# EAGLE schematic SyncScan Standalone MK3 SMD (EAGLE 6.2)
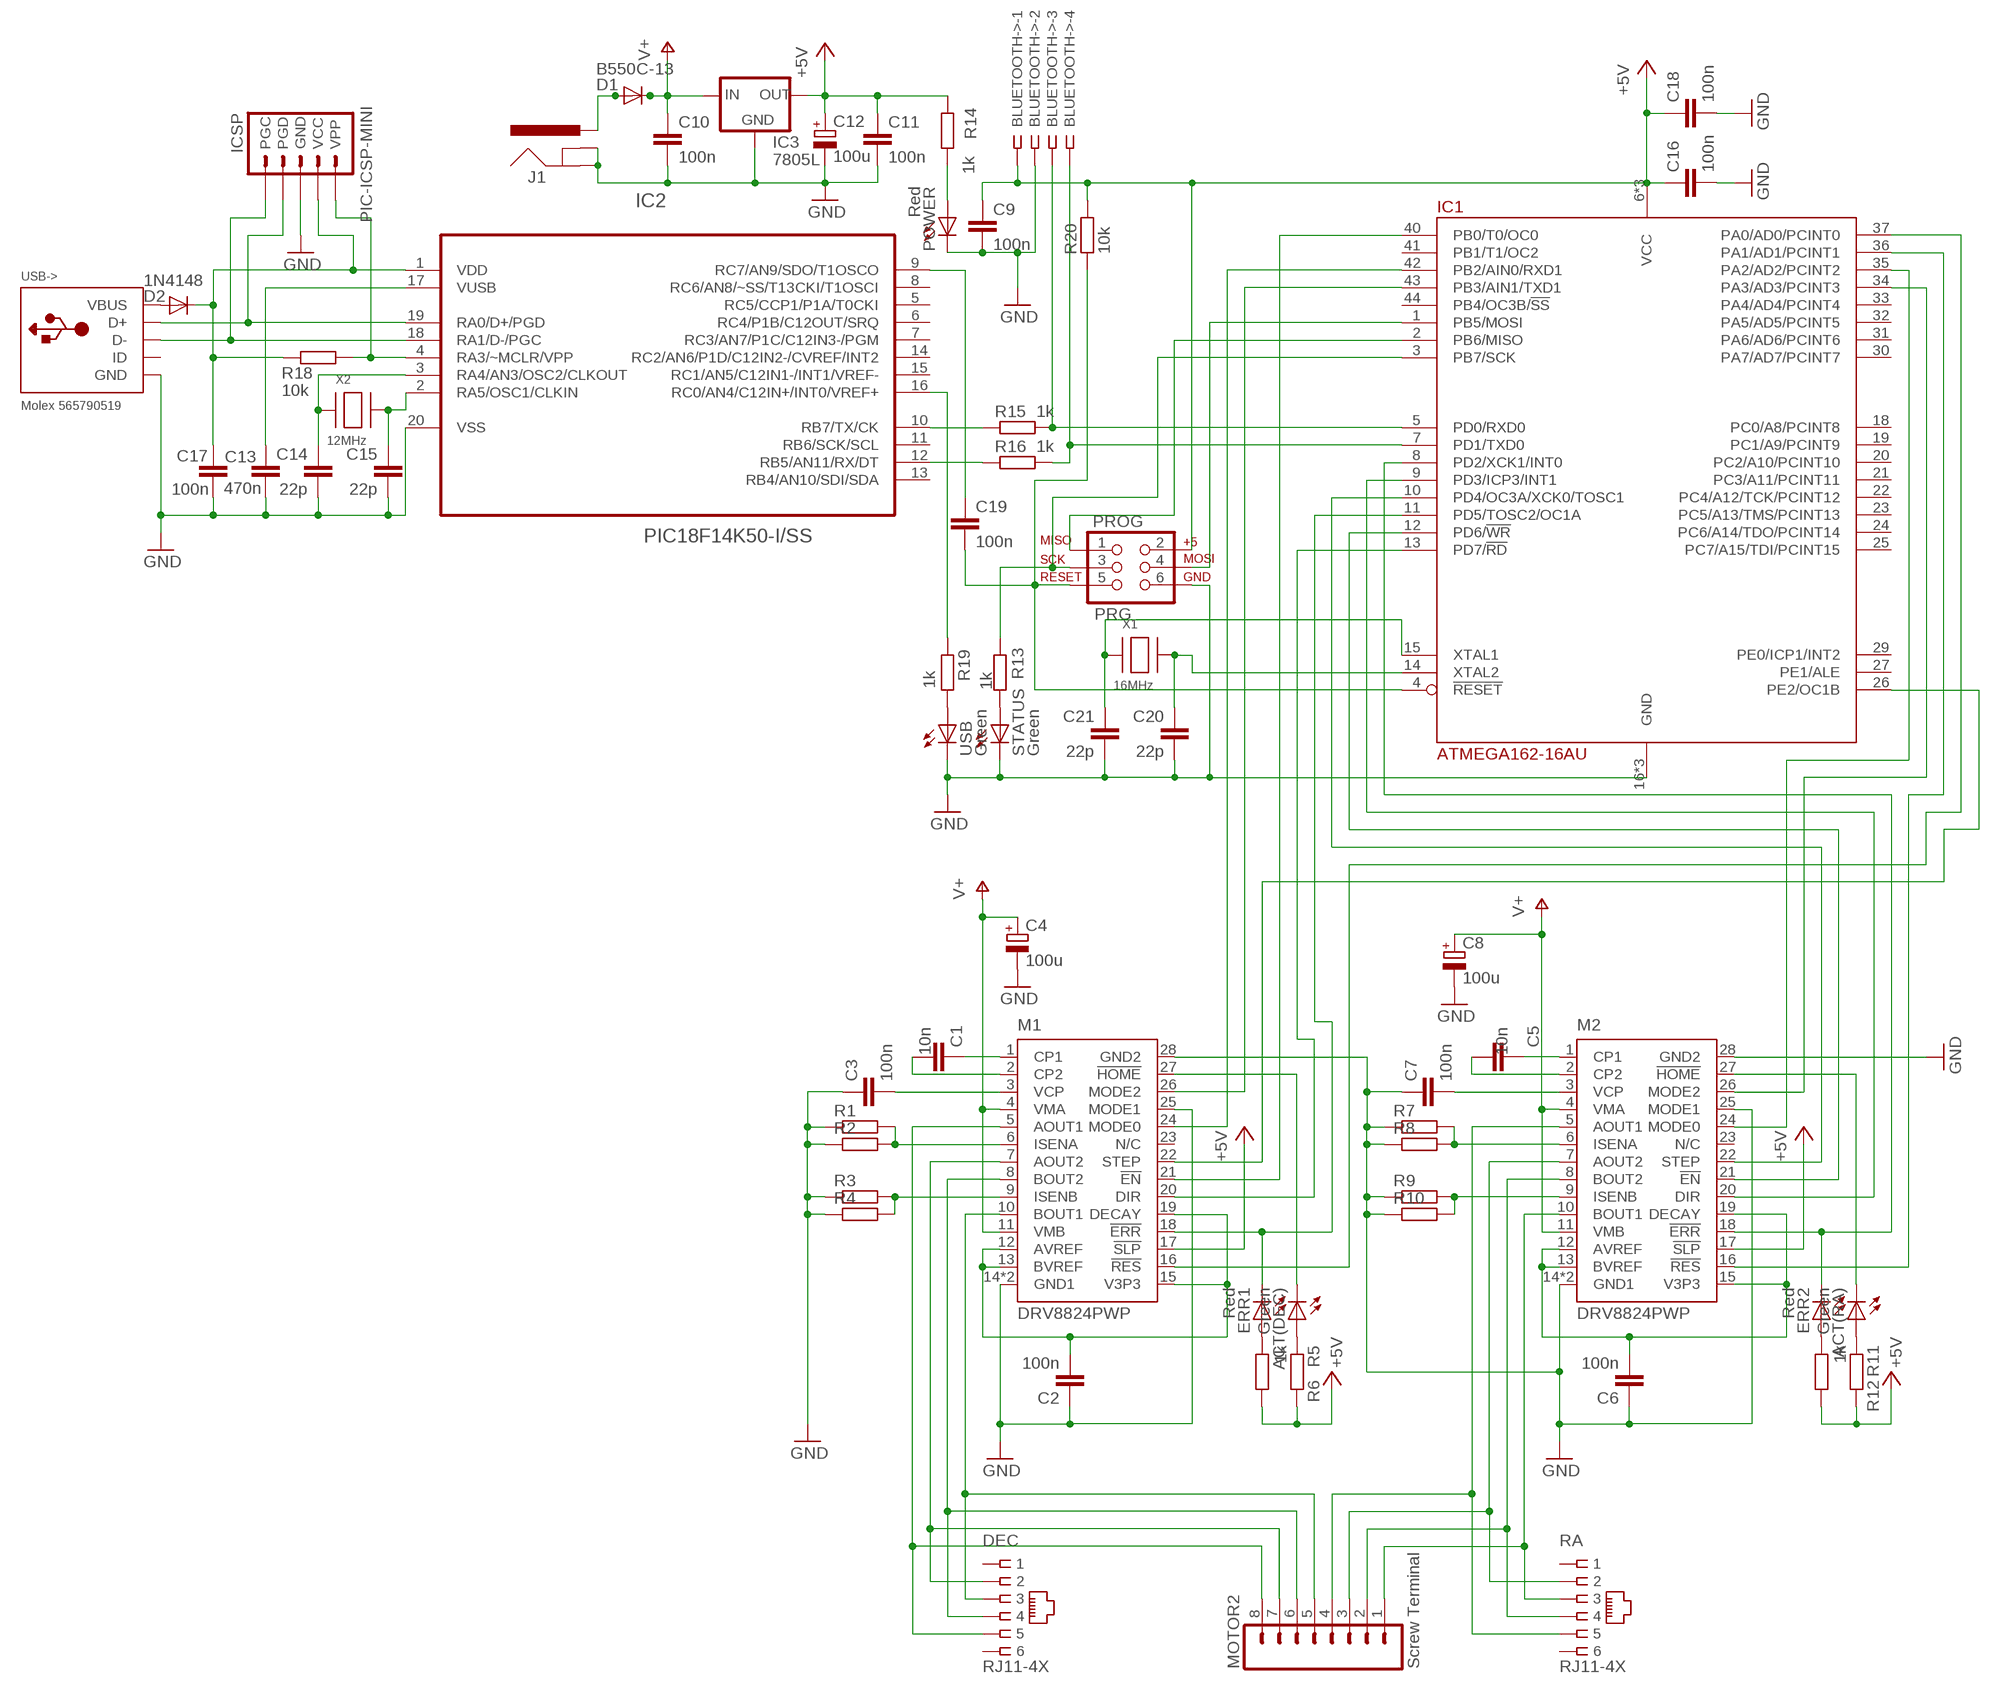
[diagram p0: schematic, sheet 1]

## Parts
ACT(DEC)  Green  LEDSMT1206  [1206]
ACT(RA)  Green  LEDSMT1206  [1206]
BLUETOOTH->  http://www.ebay.co.uk/itm/250991624201  SSW-104-02-S-S-RA  [SSW-104-02-S-S-RA]
C1  10n  C-EUC0603K  [C0603K]
C2  100n  C-EUC0603K  [C0603K]
C3  100n  C-EUC0603K  [C0603K]
C4  100u  CPOL-EUE2.5-6  [E2,5-6]
C5  10n  C-EUC0603K  [C0603K]
C6  100n  C-EUC0603K  [C0603K]
C7  100n  C-EUC0603K  [C0603K]
C8  100u  CPOL-EUE2.5-6  [E2,5-6]
C9  100n  C-EUC0603K  [C0603K]
C10  100n  C-EUC0603K  [C0603K]
C11  100n  C-EUC0603K  [C0603K]
C12  100u  CPOL-EUE2.5-6  [E2,5-6]
C13  470n  C-EUC0603K  [C0603K]
C14  22p  C-EUC0603K  [C0603K]
C15  22p  C-EUC0603K  [C0603K]
C16  100n  C-EUC0603K  [C0603K]
C17  100n  C-EUC0603K  [C0603K]
C18  100n  C-EUC0603K  [C0603K]
C19  100n  C-EUC0603K  [C0603K]
C20  22p  C-EUC0603K  [C0603K]
C21  22p  C-EUC0603K  [C0603K]
D1  B550C-13  DIODE-SMC  [SMC]
D2  1N4148  DIODESOD  [SOD-323]
DEC  RJ11-4X  [RJ11-NO_SHIELD]
ERR1  Red  LEDSMT1206  [1206]
ERR2  Red  LEDSMT1206  [1206]
IC1  ATMEGA162-16AU  [TQFP44]
IC2  PIC18F14K50-I/SS  [SSOP20]
IC3  7805L  78LXXSOT-23  [SOT23]
ICSP  PIC-ICSP-MINI  [PIC-ICSP-MINI]
J1  POWER_JACKSMD  [POWER_JACK_SMD]
M1  DRV8824PWP  [HTSSOP28PWP]
M2  DRV8824PWP  [HTSSOP28PWP]
MOTOR2  Screw Terminal  M083.5MM-8  [SCREWTERMINAL-3.5MM-8]
POWER  Red  LEDSMT1206  [1206]
PROG  PRG  AVR_SPI_PRG_6PTH  [2X3]
R1  1.5R  R-EU_R2512  [R2512]
R2  1.5R  R-EU_R2512  [R2512]
R3  1.5R  R-EU_R2512  [R2512]
R4  1.5R  R-EU_R2512  [R2512]
R5  1k  R-EU_R0603  [R0603]
R6  1k  R-EU_R0603  [R0603]
R7  1.5R  R-EU_R2512  [R2512]
R8  1.5R  R-EU_R2512  [R2512]
R9  1.5R  R-EU_R2512  [R2512]
R10  1.5R  R-EU_R2512  [R2512]
R11  1k  R-EU_R0603  [R0603]
R12  1k  R-EU_R0603  [R0603]
R13  1k  R-EU_R0603  [R0603]
R14  1k  R-EU_R0603  [R0603]
R15  1k  R-EU_R0603  [R0603]
R16  1k  R-EU_R0603  [R0603]
R18  10k  R-EU_R0603  [R0603]
R19  1k  R-EU_R0603  [R0603]
R20  10k  R-EU_R0603  [R0603]
RA  RJ11-4X  [RJ11-NO_SHIELD]
STATUS  Green  LEDSMT1206  [1206]
USB  Green  LEDSMT1206  [1206]
USB->  Molex 565790519  USBMOLEX  [USB-MINIB-THM-MOLEX]
X1  16MHz  XTALNX5032  [NX5032]
X2  12MHz  XTALNX5032  [NX5032]

## Nets
3.3V-1: C2.2 M1.12(AVREF) M1.13(BVREF) M1.15(V3P3) M1.19(DECAY)
3.3V-2: C6.2 M2.12(AVREF) M2.13(BVREF) M2.15(V3P3) M2.19(DECAY)
!EN-1: IC1.40(PB0/T0/OC0) M1.21(!EN)
!EN-2: IC1.12(PD6/!WR) M2.21(!EN)
!ERR-1: ERR1.C IC1.11(PD5/TOSC2/OC1A) M1.18(!ERR)
!ERR-2: ERR2.C IC1.8(PD2/XCK1/INT0) M2.18(!ERR)
!HOME-1: ACT(DEC).C M1.27(!HOME)
!HOME-2: ACT(RA).C M2.27(!HOME)
!RST-1: IC1.37(PA0/AD0/PCINT0) M1.16(!RES)
!RST-2: IC1.36(PA1/AD1/PCINT1) M2.16(!RES)
+5V: BLUETOOTH->.1 C9.1 C11.1 C12.+ C16.1 C18.1 IC1.6(VCC) IC1.17(VCC) IC1.38(VCC) IC3.1(OUT) M1.17(!SLP) M2.17(!SLP) PROG.2 R5.2 R6.2 R11.2 R12.2 R14.1 R20.2
A1-1: DEC.5 M1.5(AOUT1) MOTOR2.8
A1-2: M2.5(AOUT1) MOTOR2.4 RA.5
A2-1: DEC.2 M1.7(AOUT2) MOTOR2.7
A2-2: M2.7(AOUT2) MOTOR2.3 RA.2
AVROSC1: C21.1 IC1.15(XTAL1) X1.P$1
AVROSC2: C20.1 IC1.14(XTAL2) X1.P$2
B1-1: DEC.3 M1.10(BOUT1) MOTOR2.5
B1-2: M2.10(BOUT1) MOTOR2.1 RA.3
B2-1: DEC.4 M1.8(BOUT2) MOTOR2.6
B2-2: M2.8(BOUT2) MOTOR2.2 RA.4
CP1-1: C1.1 M1.1(CP1)
CP1-2: C5.1 M2.1(CP1)
CP2-1: C1.2 M1.2(CP2)
CP2-2: C5.2 M2.2(CP2)
D+: IC2.19(RA0/D+/PGD) ICSP.4(PGD) USB->.D+
D-: IC2.18(RA1/D-/PGC) ICSP.5(PGC) USB->.D-
DIR-1: IC1.13(PD7/!RD) M1.20(DIR)
DIR-2: IC1.9(PD3/ICP3/INT1) M2.20(DIR)
GND: BLUETOOTH->.2 C2.1 C3.1 C4.- C6.1 C7.1 C8.- C9.2 C10.2 C11.2 C12.- C13.1 C14.2 C15.2 C16.2 C17.2 C18.2 C20.2 C21.2 IC1.16(GND) IC1.28(GND) IC1.39(GND) IC2.20(VSS) IC3.3(GND) ICSP.3(GND) J1.GND(GNDBREAK) J1.P$4(GND) M1.14(GND1) M1.25(MODE1) M1.28(GND2) M1.EXP(GND1) M2.14(GND1) M2.25(MODE1) M2.28(GND2) M2.EXP(GND1) POWER.C PROG.6 R1.1 R2.1 R3.1 R4.1 R7.1 R8.1 R9.1 R10.1 STATUS.C USB->.GND USB.C
ISENA-1: M1.6(ISENA) R1.2 R2.2
ISENA-2: M2.6(ISENA) R7.2 R8.2
ISENB-1: M1.9(ISENB) R3.2 R4.2
ISENB-2: M2.9(ISENB) R9.2 R10.2
LED1: ERR1.A R6.1
LED2: ACT(DEC).A R5.1
LED3: ERR2.A R12.1
LED4: ACT(RA).A R11.1
M0-1: IC1.42(PB2/AIN0/RXD1) M1.24(MODE0)
M0-2: IC1.35(PA2/AD2/PCINT2) M2.24(MODE0)
M2-1: IC1.43(PB3/AIN1/TXD1) M1.26(MODE2)
M2-2: IC1.34(PA3/AD3/PCINT3) M2.26(MODE2)
MCLR: IC2.4(RA3/~MCLR/VPP) ICSP.1(VPP) R18.1
MISO: IC1.2(PB6/MISO) PROG.1
MOSI: IC1.1(PB5/MOSI) PROG.4
N$1: C3.2 M1.3(VCP)
N$2: C19.1 IC2.9(RC7/AN9/SDO/T1OSCO)
PWRLED: POWER.A R14.2
RESET: C19.2 IC1.4(!RESET) PROG.5 R20.1
RX(BTH): BLUETOOTH->.4 IC1.7(PD1/TXD0) R16.1
RX(USB): IC2.12(RB5/AN11/RX/DT) R16.2
SCLK: IC1.3(PB7/SCK) PROG.3 R13.1
STATLED: R13.2 STATUS.A
STEP-1: IC1.26(PE2/OC1B) M1.22(STEP)
STEP-2: IC1.10(PD4/OC3A/XCK0/TOSC1) M2.22(STEP)
TX(BTH): BLUETOOTH->.3 IC1.5(PD0/RXD0) R15.1
TX(USB): IC2.10(RB7/TX/CK) R15.2
USBLED: R19.1 USB.A
USBOSC1: C15.1 IC2.2(RA5/OSC1/CLKIN) X2.P$2
USBOSC2: C14.1 IC2.3(RA4/AN3/OSC2/CLKOUT) X2.P$1
USBSTAT: IC2.16(RC0/AN4/C12IN+/INT0/VREF+) R19.2
V+: C4.+ C8.+ C10.1 D1.C IC3.2(IN) M1.4(VMA) M1.11(VMB) M2.4(VMA) M2.11(VMB)
VBUS: D2.2(A) USB->.VBUS
VCP-2: C7.2 M2.3(VCP)
VIN: D1.A J1.VIN0(PWR) J1.VIN1(PWR)
VPIC: C17.1 D2.1(C) IC2.1(VDD) ICSP.2(VCC) R18.2
VUSB: C13.2 IC2.17(VUSB)
Unconnected: DEC.1 DEC.6 IC1.18(PC0/A8/PCINT8) IC1.19(PC1/A9/PCINT9) IC1.20(PC2/A10/PCINT10) IC1.21(PC3/A11/PCINT11) IC1.22(PC4/A12/TCK/PCINT12) IC1.23(PC5/A13/TMS/PCINT13) IC1.24(PC6/A14/TDO/PCINT14) IC1.25(PC7/A15/TDI/PCINT15) IC1.27(PE1/ALE) IC1.29(PE0/ICP1/INT2) IC1.30(PA7/AD7/PCINT7) IC1.31(PA6/AD6/PCINT6) IC1.32(PA5/AD5/PCINT5) IC1.33(PA4/AD4/PCINT4) IC1.41(PB1/T1/OC2) IC1.44(PB4/OC3B/!SS) IC2.5(RC5/CCP1/P1A/T0CKI) IC2.6(RC4/P1B/C12OUT/SRQ) IC2.7(RC3/AN7/P1C/C12IN3-/PGM) IC2.8(RC6/AN8/~SS/T13CKI/T1OSCI) IC2.11(RB6/SCK/SCL) IC2.13(RB4/AN10/SDI/SDA) IC2.14(RC2/AN6/P1D/C12IN2-/CVREF/INT2) IC2.15(RC1/AN5/C12IN1-/INT1/VREF-) M1.23(N/C) M2.23(N/C) RA.1 RA.6 USB->.ID

## Library data of the parts
ACT(DEC) ACT(RA) STATUS USB = led:LED: LED OSRAM: - CHIPLED LG R971, LG N971, LY N971, LG Q971, LY Q971, LO R971, LY R971 LH N974, LH R974 LS Q976, LO Q976, LY Q976 LO Q996 - Hyper CHIPLED LW Q18S LB Q993, LB Q99A, LB R99A - SideLED LS A670, LO A670, LY A670, LG A670, LP A670 LB A673, LV A673, LT A673, LW A673 LH A674 LY A675 LS A676, LA A676, LO A676, LY A676, LW A676 LS A679, LY A679, LG A679 - Hyper Micro SIDELED® LS Y876, LA Y876, LO Y876, LY Y876 LT Y87S - SmartLED LW L88C, LW L88S LB L89C, LB L89S, LG L890 LS L89K, LO L89K, LY L89K LS L896, LA L896, LO L896, LY L896 - TOPLED LS T670, LO T670, LY T670, LG T670, LP T670 LSG T670, LSP T670, LSY T670, LOP T670, LYG T670 LG T671, LOG T671, LSG T671 LB T673, LV T673, LT T673, LW T673 LH T674 LS T676, LA T676, LO T676, LY T676, LB T676, LH T676, LSB T676, LW T676 LB T67C, LV T67C, LT T67C, LS T67K, LO T67K, LY T67K, LW E67C LS E67B, LA E67B, LO E67B, LY E67B, LB E67C, LV E67C, LT E67C LW T67C LS T679, LY T679, LG T679 LS T770, LO T770, LY T770, LG T770, LP T770 LB T773, LV T773, LT T773, LW T773 LH T774 LS E675, LA E675, LY E675, LS T675 LS T776, LA T776, LO T776, LY T776, LB T776 LHGB T686 LT T68C, LB T68C - Hyper Mini TOPLED® LB M676 - Mini TOPLED Santana® LG M470 LS M47K, LO M47K, LY M47K Source: http://www.osram.convergy.de/; MF: KINGBRIGHT; MPN: L-424GDT; OC_FARNELL: 1142496
BLUETOOTH-> = con-samtec:SSW-104-02-S-S: THROUGH-HOLE .025" SQ POST SOCKET Source: Samtec SSW.pdf; OC_FARNELL: unknown; OC_NEWARK: 11P9385
C1 C5 = resistor:C-EU: CAPACITOR, European symbol; MF: KEMET; MPN: C0603C103K1RACTU; OC_FARNELL: 1865545
C2 C3 C6 C7 C9-C11 C16-C19 = resistor:C-EU: CAPACITOR, European symbol; MF: KEMET; MPN: C0603C104K4RACTU; OC_FARNELL: 1414610
C4 C8 C12 = resistor:CPOL-EU: POLARIZED CAPACITOR, European symbol; MF: MULTICOMP; MPN: MCGPR25V107M6.3X11; OC_FARNELL: 9451188
C13 = rcl:C-EU: CAPACITOR, European symbol; MF: AVX; MPN: 0603ZD474KAT2A; OC_FARNELL: 1833805
C14 C15 C20 C21 = rcl:C-EU: CAPACITOR, European symbol; MF: MULTICOMP; MPN: U0603C220JCT; OC_FARNELL: 9406107
D1 = diode:DIODE-: DIODE; MF: DIODES INC.; MPN: B550C-13-F; OC_FARNELL: 1858608
D2 = SparkFun:DIODE: Diode These are standard reverse protection diodes and small signal diodes. SMA package can handle up to about 1A. SOD-323 can handle about 200mA. What the SOD-323 package when ordering, there are some mfgs out there that are 5-pin packages.; MF: MULTICOMP; MPN: 1N4148.; OC_FARNELL: 9565124
DEC RA = con-tycoelectronics:RJ11: CORCOM Modular RJ Jacks No Shield Source: www.tycoelectronics.com .. ENG_DS_1654001_1099_RJ_L_0507.pdf; MF: MH CONNECTORS; MPN: MHRJJ64NFRA; OC_FARNELL: 3938347; OC_NEWARK: 19R7022
ERR1 ERR2 POWER = led:LED: LED OSRAM: - CHIPLED LG R971, LG N971, LY N971, LG Q971, LY Q971, LO R971, LY R971 LH N974, LH R974 LS Q976, LO Q976, LY Q976 LO Q996 - Hyper CHIPLED LW Q18S LB Q993, LB Q99A, LB R99A - SideLED LS A670, LO A670, LY A670, LG A670, LP A670 LB A673, LV A673, LT A673, LW A673 LH A674 LY A675 LS A676, LA A676, LO A676, LY A676, LW A676 LS A679, LY A679, LG A679 - Hyper Micro SIDELED® LS Y876, LA Y876, LO Y876, LY Y876 LT Y87S - SmartLED LW L88C, LW L88S LB L89C, LB L89S, LG L890 LS L89K, LO L89K, LY L89K LS L896, LA L896, LO L896, LY L896 - TOPLED LS T670, LO T670, LY T670, LG T670, LP T670 LSG T670, LSP T670, LSY T670, LOP T670, LYG T670 LG T671, LOG T671, LSG T671 LB T673, LV T673, LT T673, LW T673 LH T674 LS T676, LA T676, LO T676, LY T676, LB T676, LH T676, LSB T676, LW T676 LB T67C, LV T67C, LT T67C, LS T67K, LO T67K, LY T67K, LW E67C LS E67B, LA E67B, LO E67B, LY E67B, LB E67C, LV E67C, LT E67C LW T67C LS T679, LY T679, LG T679 LS T770, LO T770, LY T770, LG T770, LP T770 LB T773, LV T773, LT T773, LW T773 LH T774 LS E675, LA E675, LY E675, LS T675 LS T776, LA T776, LO T776, LY T776, LB T776 LHGB T686 LT T68C, LB T68C - Hyper Mini TOPLED® LB M676 - Mini TOPLED Santana® LG M470 LS M47K, LO M47K, LY M47K Source: http://www.osram.convergy.de/; MF: KINGBRIGHT; MPN: L-424HDT; OC_FARNELL: 1142499
IC1 = atmel:ATMEGA162: 8-bit RISC MICROCONTROLLER 16K Bytes internal flash program memory 1K Bytes internal SRAM Upto 64K Bytes optional external memory space 512 Bytes EEPROM Two 8-bit timers Two 16-bit timers Dual programmable serial USARTs Master/Slave serial SPI interface Source: ATMEGA162_DIP40.lbr; MF: ATMEL; MPN: ATMEGA162-16AU; OC_FARNELL: 9171150
IC2 = microchip:PIC18F14K50: USB Flash Microcontrollers; MF: MICROCHIP; MPN: PIC18F14K50-I/SS; OC_FARNELL: 1648504
IC3 = v-reg:78LXX: VOLTAGE REGULATOR; MF: TAIWAN SEMICONDUCTOR; MPN: TS78L05CX RF; OC_FARNELL: 1476698
ICSP = SparkFun:PIC-ICSP-MINI: PIC-ICSP-Mini Miniature 5-pin connection for temporary programming of PICs. Use this device in your design to save space. Program the PIC with this adapter Spark Fun Electronics SKU : BOB-00194; OC_FARNELL: unknown
J1 = SparkFun:POWER_JACK: Power Jack This is the standard 5.5mm barrel jack for power. The PTH is the most common, proven, reliable, footprint. All others are experimental. The Slot footprint only works if the mill layer is transmitted to the PCB fab house so be warned. Spark Fun Electronics SKU : PRT-00119. Mating wall wart : TOL-00298 (and others); MF: MULTICOMP; MPN: MJ-179SMT; OC_FARNELL: 1737262
M1 M2 = texas:DRV8824; MF: TEXAS INSTRUMENTS; MPN: DRV8824PWP; OC_FARNELL: 1815786
MOTOR2 = SparkFun:M08: Header 8 Standard 8-pin 0.1" header. Use with straight break away headers (SKU : PRT-00116), right angle break away headers (PRT-00553), swiss pins (PRT-00743), machine pins (PRT-00117), and female headers (PRT-00115).; MF: LUMBERG; MPN: KRMC 08; OC_FARNELL: 1217307
PROG = SparkFun:AVR_SPI_PRG_6: AVR ISP 6 Pin This is the reduced ISP connector for AVR programming. Common on Arduino. This footprint will take up less PCB space and can be used with a 10-pin to 6-pin adapter such as SKU: BOB-08508; MF: TE CONNECTIVITY / AMP; MPN: 826632-3; OC_FARNELL: 3418492
R1-R4 R7-R10 = resistor:R-EU_: RESISTOR, European symbol; MF: YAGEO (PHYCOMP); MPN: RC2512FK-7W1R5L; OC_FARNELL: 1840520
R5 R6 R11 R12 = resistor:R-EU_: RESISTOR, European symbol; MF: VISHAY DRALORIC; MPN: CRCW06031K00FKEA; OC_FARNELL: 1469740
R13 R14 R19 = rcl:R-EU_: RESISTOR, European symbol; MF: VISHAY DRALORIC; MPN: CRCW06031K00FKEA; OC_FARNELL: 1469740
R15 R16 = SmartPrj:R-EU_: RESISTOR, European symbol; MF: VISHAY DRALORIC; MPN: CRCW06031K00FKEA; OC_FARNELL: 1469740
R18 R20 = rcl:R-EU_: RESISTOR, European symbol; MF: VISHAY DRALORIC; MPN: CRCW060310K0FKEA; OC_FARNELL: 1469748
USB-> = adafruit:USB: USB Connectors USBMINIB - Surface Mount Female Mini-B USB Connector 4UConnector: 06564 By microbuilder.eu Thru-hole RA Female Mini-B USB Connector 4UConnector: 18732 By ladyada.net; MF: MOLEX; MPN: 565790519; OC_FARNELL: 1125347
X1 = adafruit:XTAL: Low cost SMT crystals, no capacitors included http://www.ladyada.net/library/eagle; MF: TXC; MPN: 7A-16.000MAAJ-T; OC_FARNELL: 1841946
X2 = adafruit:XTAL: Low cost SMT crystals, no capacitors included http://www.ladyada.net/library/eagle; MF: TXC; MPN: 7A-12.000MAAJ-T; OC_FARNELL: 1841940

## Net classes
1 power: width 0.61 mm, drill 0.711 mm, clearance 0.203 mm
2 gnd: width 0.305 mm, drill 0.711 mm, clearance 0.203 mm
3 usbvcc: width 0.508 mm, drill 0.711 mm, clearance 0.203 mm